# Altium project SDP_2.PrjPcb
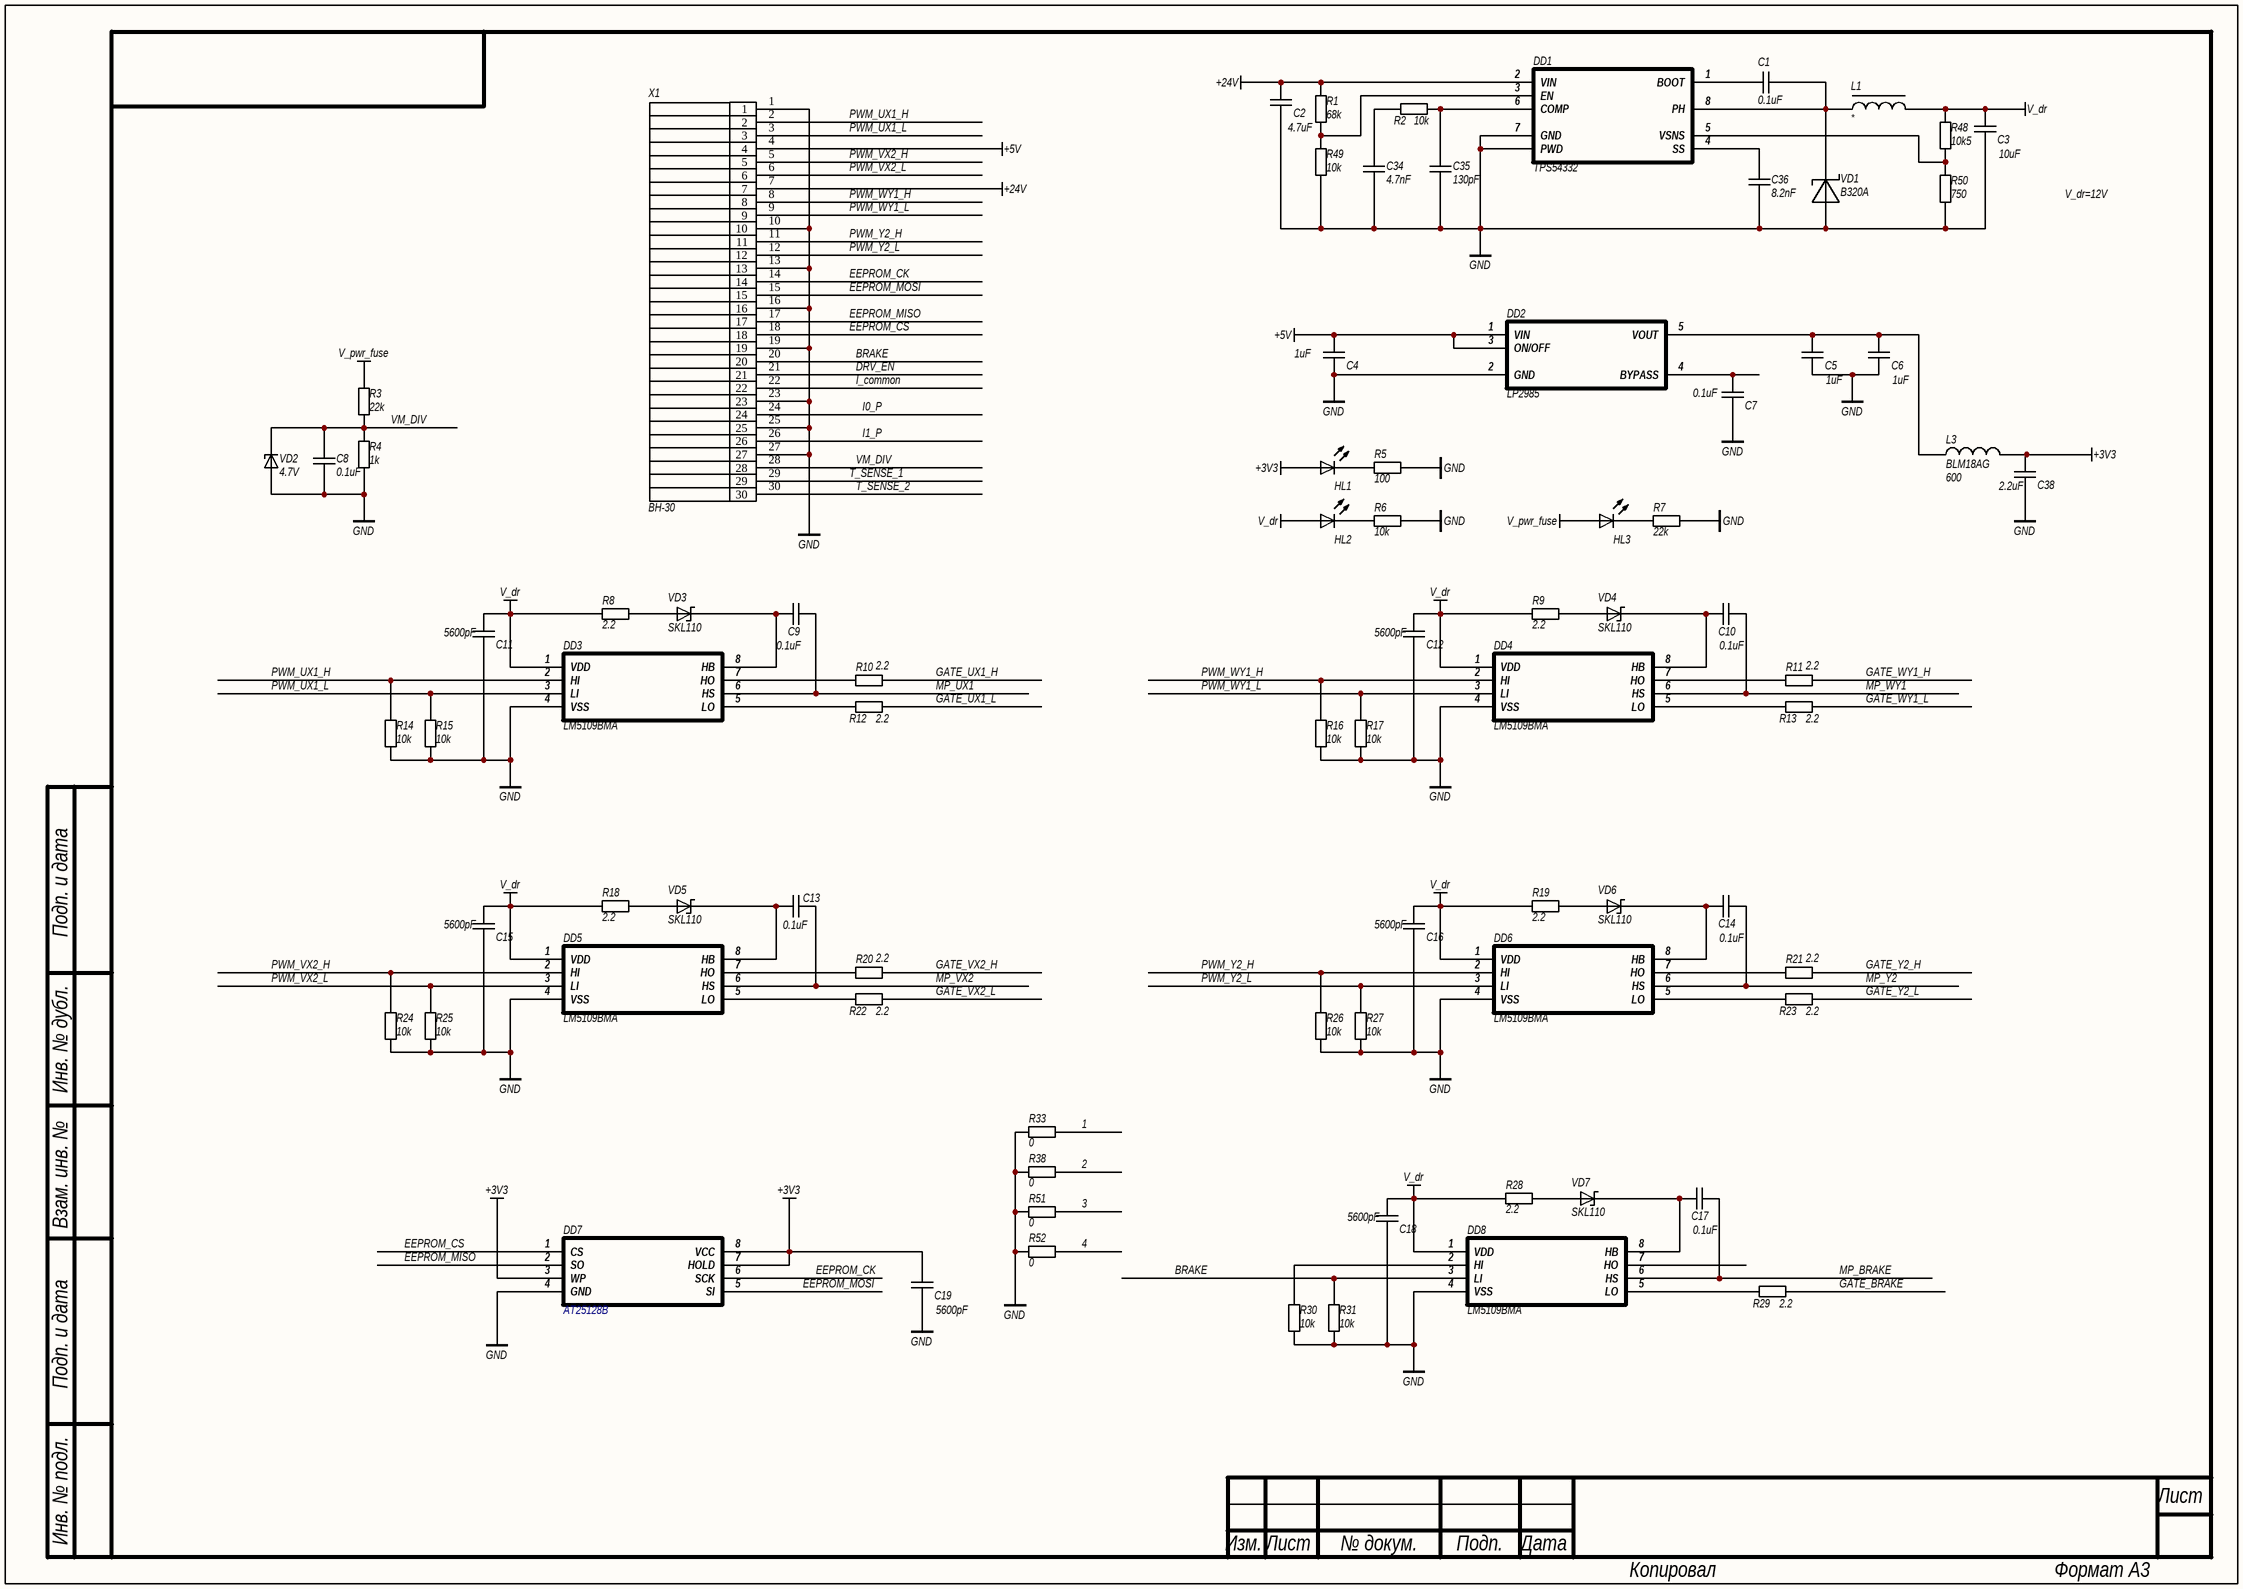
[diagram p0: SDP_1.SchDoc]
2 sheets, 144 parts. Net scope: global (net labels, ports and power ports of the same name join across sheets).
Board file: SDP.PcbDoc
Sheets:
  SDP_1.SchDoc
  SDP_2.SchDoc

## Sheet SDP_1.SchDoc
size 420 x 297 mm; PageSetup: Record=PageOptions|CenterHorizontal=False|CenterVertical=False|PrintScale=0.95|XCorrection=0.00|YCorrection=0.00|PrintKind=1|BorderSize=5000000|LeftOffset=0|BottomOffset=0|Orientation=1|PaperLength=1000|PaperWidth=1000|Scale=100|PaperSource=15|PrintQuality=600|MediaType=1|DitherType=10|PaperKind=A4|PrintScaleMode=1

### Parts
C1  value 0.1uF  [C0603]  (hidden comment: CAP)
C2  value 4.7uF  [C1210]  (hidden comment: CAP)
C3  value 10uF  [C1210]  (hidden comment: CAP)
C4  value 1uF  [C0603]  (hidden comment: CAP)
C5  value 1uF  [C0603]  (hidden comment: CAP)
C6  value 1uF  [C0603]  (hidden comment: CAP)
C7  value 0.1uF  [C0603]  (hidden comment: CAP)
C8  value 0.1uF  [C0603]  (hidden comment: CAP)
C9  value 0.1uF  [C0603]  (hidden comment: CAP)
C10  value 0.1uF  [C0603]  (hidden comment: CAP)
C11  value 5600pF  [C0603]  (hidden comment: CAP)
C12  value 5600pF  [C0603]  (hidden comment: CAP)
C13  value 0.1uF  [C0603]  (hidden comment: CAP)
C14  value 0.1uF  [C0603]  (hidden comment: CAP)
C15  value 5600pF  [C0603]  (hidden comment: CAP)
C16  value 5600pF  [C0603]  (hidden comment: CAP)
C17  value 0.1uF  [C0603]  (hidden comment: CAP)
C18  value 5600pF  [C0603]  (hidden comment: CAP)
C19  value 5600pF  [C0603]  (hidden comment: CAP)
C34  value 4.7nF  [C0603]  (hidden comment: CAP)
C35  value 130pF  [C0603]  (hidden comment: CAP)
C36  value 8.2nF  [C0603]  (hidden comment: CAP)
C38  value 2.2uF  [C0603]  (hidden comment: CAP)
DD1  TPS54332  [DDA]
DD2  LP2985  [SOT23-5]
DD3  LM5109BMA  [SO8_L]
DD4  LM5109BMA  [SO8_L]
DD5  LM5109BMA  [SO8_L]
DD6  LM5109BMA  [SO8_L]
DD7  AT25128B  [SO8_L]
DD8  LM5109BMA  [SO8_L]
HL1  LED0603  [LED0603]  (value not drawn)
HL2  LED0603  [LED0603]  (value not drawn)
HL3  LED0603  [LED0603]  (value not drawn)
L1  XAL5050  [XAL5050]  (value not drawn)
L3  BLM18AG  value 600  [R0603]
R1  value 68k  [R0603]  (hidden comment: RES)
R2  value 10k  [R0603]  (hidden comment: RES)
R3  value 22k  [R0603]  (hidden comment: RES)
R4  value 1k  [R0603]  (hidden comment: RES)
R5  value 100  [R0603]  (hidden comment: RES)
R6  value 10k  [R0603]  (hidden comment: RES)
R7  value 22k  [R0603]  (hidden comment: RES)
R8  value 2.2  [R0603]  (hidden comment: RES)
R9  value 2.2  [R0603]  (hidden comment: RES)
R10  value 2.2  [R0603]  (hidden comment: RES)
R11  value 2.2  [R0603]  (hidden comment: RES)
R12  value 2.2  [R0603]  (hidden comment: RES)
R13  value 2.2  [R0603]  (hidden comment: RES)
R14  value 10k  [R0603]  (hidden comment: RES)
R15  value 10k  [R0603]  (hidden comment: RES)
R16  value 10k  [R0603]  (hidden comment: RES)
R17  value 10k  [R0603]  (hidden comment: RES)
R18  value 2.2  [R0603]  (hidden comment: RES)
R19  value 2.2  [R0603]  (hidden comment: RES)
R20  value 2.2  [R0603]  (hidden comment: RES)
R21  value 2.2  [R0603]  (hidden comment: RES)
R22  value 2.2  [R0603]  (hidden comment: RES)
R23  value 2.2  [R0603]  (hidden comment: RES)
R24  value 10k  [R0603]  (hidden comment: RES)
R25  value 10k  [R0603]  (hidden comment: RES)
R26  value 10k  [R0603]  (hidden comment: RES)
R27  value 10k  [R0603]  (hidden comment: RES)
R28  value 2.2  [R0603]  (hidden comment: RES)
R29  value 2.2  [R0603]  (hidden comment: RES)
R30  value 10k  [R0603]  (hidden comment: RES)
R31  value 10k  [R0603]  (hidden comment: RES)
R33  value 0  [R0603]  (hidden comment: RES)
R38  value 0  [R0603]  (hidden comment: RES)
R48  value 10k5  [R0603]  (hidden comment: RES)
R49  value 10k  [R0603]  (hidden comment: RES)
R50  value 750  [R0603]  (hidden comment: RES)
R51  value 0  [R0603]  (hidden comment: RES)
R52  value 0  [R0603]  (hidden comment: RES)
VD1  B320A  [SMA-DO214]
VD2  Voltage: 4.7V  [SOD323]  (hidden comment: BZX384)
VD3  SKL110  [SOD-123]
VD4  SKL110  [SOD-123]
VD5  SKL110  [SOD-123]
VD6  SKL110  [SOD-123]
VD7  SKL110  [SOD-123]
X1  BH-30  [IDC-30(BH-30)]

### Nets
+3V3: C19.2 C38.2 DD7.3(WP) DD7.7(HOLD) DD7.8(VCC) HL1.1(A) L3.2
+5V: C4.2 DD2.1(VIN) DD2.3(ON/OFF) X1.4
+24V: C2.2 DD1.2(VIN) R1.2 X1.7
GND: C2.1 C3.1 C4.1 C5.1 C6.1 C7.1 C8.1 C11.1 C12.1 C15.1 C16.1 C18.1 C19.1 C34.1 C35.1 C36.1 C38.1 DD1.7(GND) DD1.9(PWD) DD2.2(GND) DD3.4(VSS) DD4.4(VSS) DD5.4(VSS) DD6.4(VSS) DD7.4(GND) DD8.4(VSS) R4.1 R5.1 R6.1 R7.1 R14.1 R15.1 R16.1 R17.1 R24.1 R25.1 R26.1 R27.1 R30.1 R31.1 R33.2 R38.2 R49.1 R50.1 R51.2 R52.2 VD1.1(A) VD2.1(A) X1.1 X1.10 X1.13 X1.16 X1.19 X1.23 X1.25 X1.27
V_dr: C3.2 C11.2 C12.2 C15.2 C16.2 C18.2 DD3.1(VDD) DD4.1(VDD) DD5.1(VDD) DD6.1(VDD) DD8.1(VDD) HL2.1(A) L1.2 R8.1 R9.1 R18.1 R19.1 R28.1 R48.2
V_pwr_fuse: HL3.1(A) R3.2  [project net BR_RES_1]
1: R33.1
2: R38.1
3: R51.1
4: R52.1
BRAKE: DD8.3(LI) R31.2 X1.20
DRV_EN: X1.21
EEPROM_CK: DD7.6(SCK) X1.14
EEPROM_CS: DD7.1(CS) X1.18
EEPROM_MISO: DD7.2(SO) X1.17
EEPROM_MOSI: DD7.5(SI) X1.15
GATE_BRAKE: R29.2
GATE_UX1_H: R10.2
GATE_UX1_L: R12.2
GATE_VX2_H: R20.2
GATE_VX2_L: R22.2
GATE_WY1_H: R11.2
GATE_WY1_L: R13.2
GATE_Y2_H: R21.2
GATE_Y2_L: R23.2
I0_P: X1.24
I1_P: X1.26
I_common: X1.22
MP_BRAKE: C17.2 DD8.6(HS)
MP_UX1: C9.2 DD3.6(HS)
MP_VX2: C13.2 DD5.6(HS)
MP_WY1: C10.2 DD4.6(HS)
MP_Y2: C14.2 DD6.6(HS)
PWM_UX1_H: DD3.2(HI) R14.2 X1.2
PWM_UX1_L: DD3.3(LI) R15.2 X1.3
PWM_VX2_H: DD5.2(HI) R24.2 X1.5
PWM_VX2_L: DD5.3(LI) R25.2 X1.6
PWM_WY1_H: DD4.2(HI) R16.2 X1.8
PWM_WY1_L: DD4.3(LI) R17.2 X1.9
PWM_Y2_H: DD6.2(HI) R26.2 X1.11
PWM_Y2_L: DD6.3(LI) R27.2 X1.12
T_SENSE_1: X1.29
T_SENSE_2: X1.30
VM_DIV: C8.2 R3.1 R4.2 VD2.2(K) X1.28
NetC1_1: C1.1 DD1.8(PH) L1.1 VD1.2(K)
NetC1_2: C1.2 DD1.1(BOOT)
NetC5_2: C5.2 C6.2 DD2.5(VOUT) L3.1
NetC7_2: C7.2 DD2.4(BYPASS)
NetC9_1: C9.1 DD3.8(HB) VD3.2(K)
NetC10_1: C10.1 DD4.8(HB) VD4.2(K)
NetC13_1: C13.1 DD5.8(HB) VD5.2(K)
NetC14_1: C14.1 DD6.8(HB) VD6.2(K)
NetC17_1: C17.1 DD8.8(HB) VD7.2(K)
NetC34_2: C34.2 R2.2
NetC35_2: C35.2 DD1.6(COMP) R2.1
NetC36_2: C36.2 DD1.4(SS)
NetDD1_3: DD1.3(EN) R1.1 R49.2
NetDD1_5: DD1.5(VSNS) R48.1 R50.2
NetDD3_5: DD3.5(LO) R12.1
NetDD3_7: DD3.7(HO) R10.1
NetDD4_5: DD4.5(LO) R13.1
NetDD4_7: DD4.7(HO) R11.1
NetDD5_5: DD5.5(LO) R22.1
NetDD5_7: DD5.7(HO) R20.1
NetDD6_5: DD6.5(LO) R23.1
NetDD6_7: DD6.7(HO) R21.1
NetDD8_2: DD8.2(HI) R30.2
NetDD8_5: DD8.5(LO) R29.1
NetHL1_2: HL1.2(K) R5.2
NetHL2_2: HL2.2(K) R6.2
NetHL3_2: HL3.2(K) R7.2
NetR8_2: R8.2 VD3.1(A)
NetR9_2: R9.2 VD4.1(A)
NetR18_2: R18.2 VD5.1(A)
NetR19_2: R19.2 VD6.1(A)
NetR28_2: R28.2 VD7.1(A)

Not connected (* = marked no-connect by the designer): DD8 7(HO)

### Notes on the sheet
- V_dr=12V
- Подп. и дата
- Инв. № дубл.
- Взам. инв. №
- Инв. № подл.
- Лист
- Изм.
- № докум.
- Подп.
- Дата
- Копировал
- Формат А3

### Library data of the parts
C1 C2 C4-C19 C34-C36 = CAP: SMD Capacitor; Manufacturer: Murata; Material: X7R; Tolerance: 10%; Voltage: 50V; Type: Ceramic Capacitor
C3 = CAP: SMD Capacitor; Manufacturer: Murata; Material: X7R; Tolerance: 10%; Voltage: 25V; Type: Ceramic Capacitor
C38 = CAP: SMD Capacitor; Manufacturer: Murata; Material: X7R; Tolerance: 10%; Voltage: 10V; Type: Ceramic Capacitor
DD2 = LP2985-33DBV: Regulator
DD3-DD6 DD8 = LM5109BMA: Gate driver
DD7 = AT25128B-SSHL: EEPROM
L1 = XAL5050: chip inductor; value: *
R1-R31 R33 R38 R48-R52 = RES: SMD Resistor; Name: Chip SMD Resistor; Power: 0.062 Wt; Tolerance: 5%; Temperature Range: -55…155°C
VD1 = B320A: Shottky diode
VD3-VD7 = SKL110: Shottky rectifier
X1 = IDC15x2_GOST

## Sheet SDP_2.SchDoc
size 420 x 297 mm; PageSetup: Record=PageOptions|CenterHorizontal=False|CenterVertical=False|PrintScale=0.95|XCorrection=0.00|YCorrection=0.00|PrintKind=1|BorderSize=5000000|LeftOffset=0|BottomOffset=0|Orientation=1|PaperLength=1000|PaperWidth=1000|Scale=100|PaperSource=15|PrintQuality=600|MediaType=1|DitherType=10|PaperKind=A4|PrintScaleMode=1
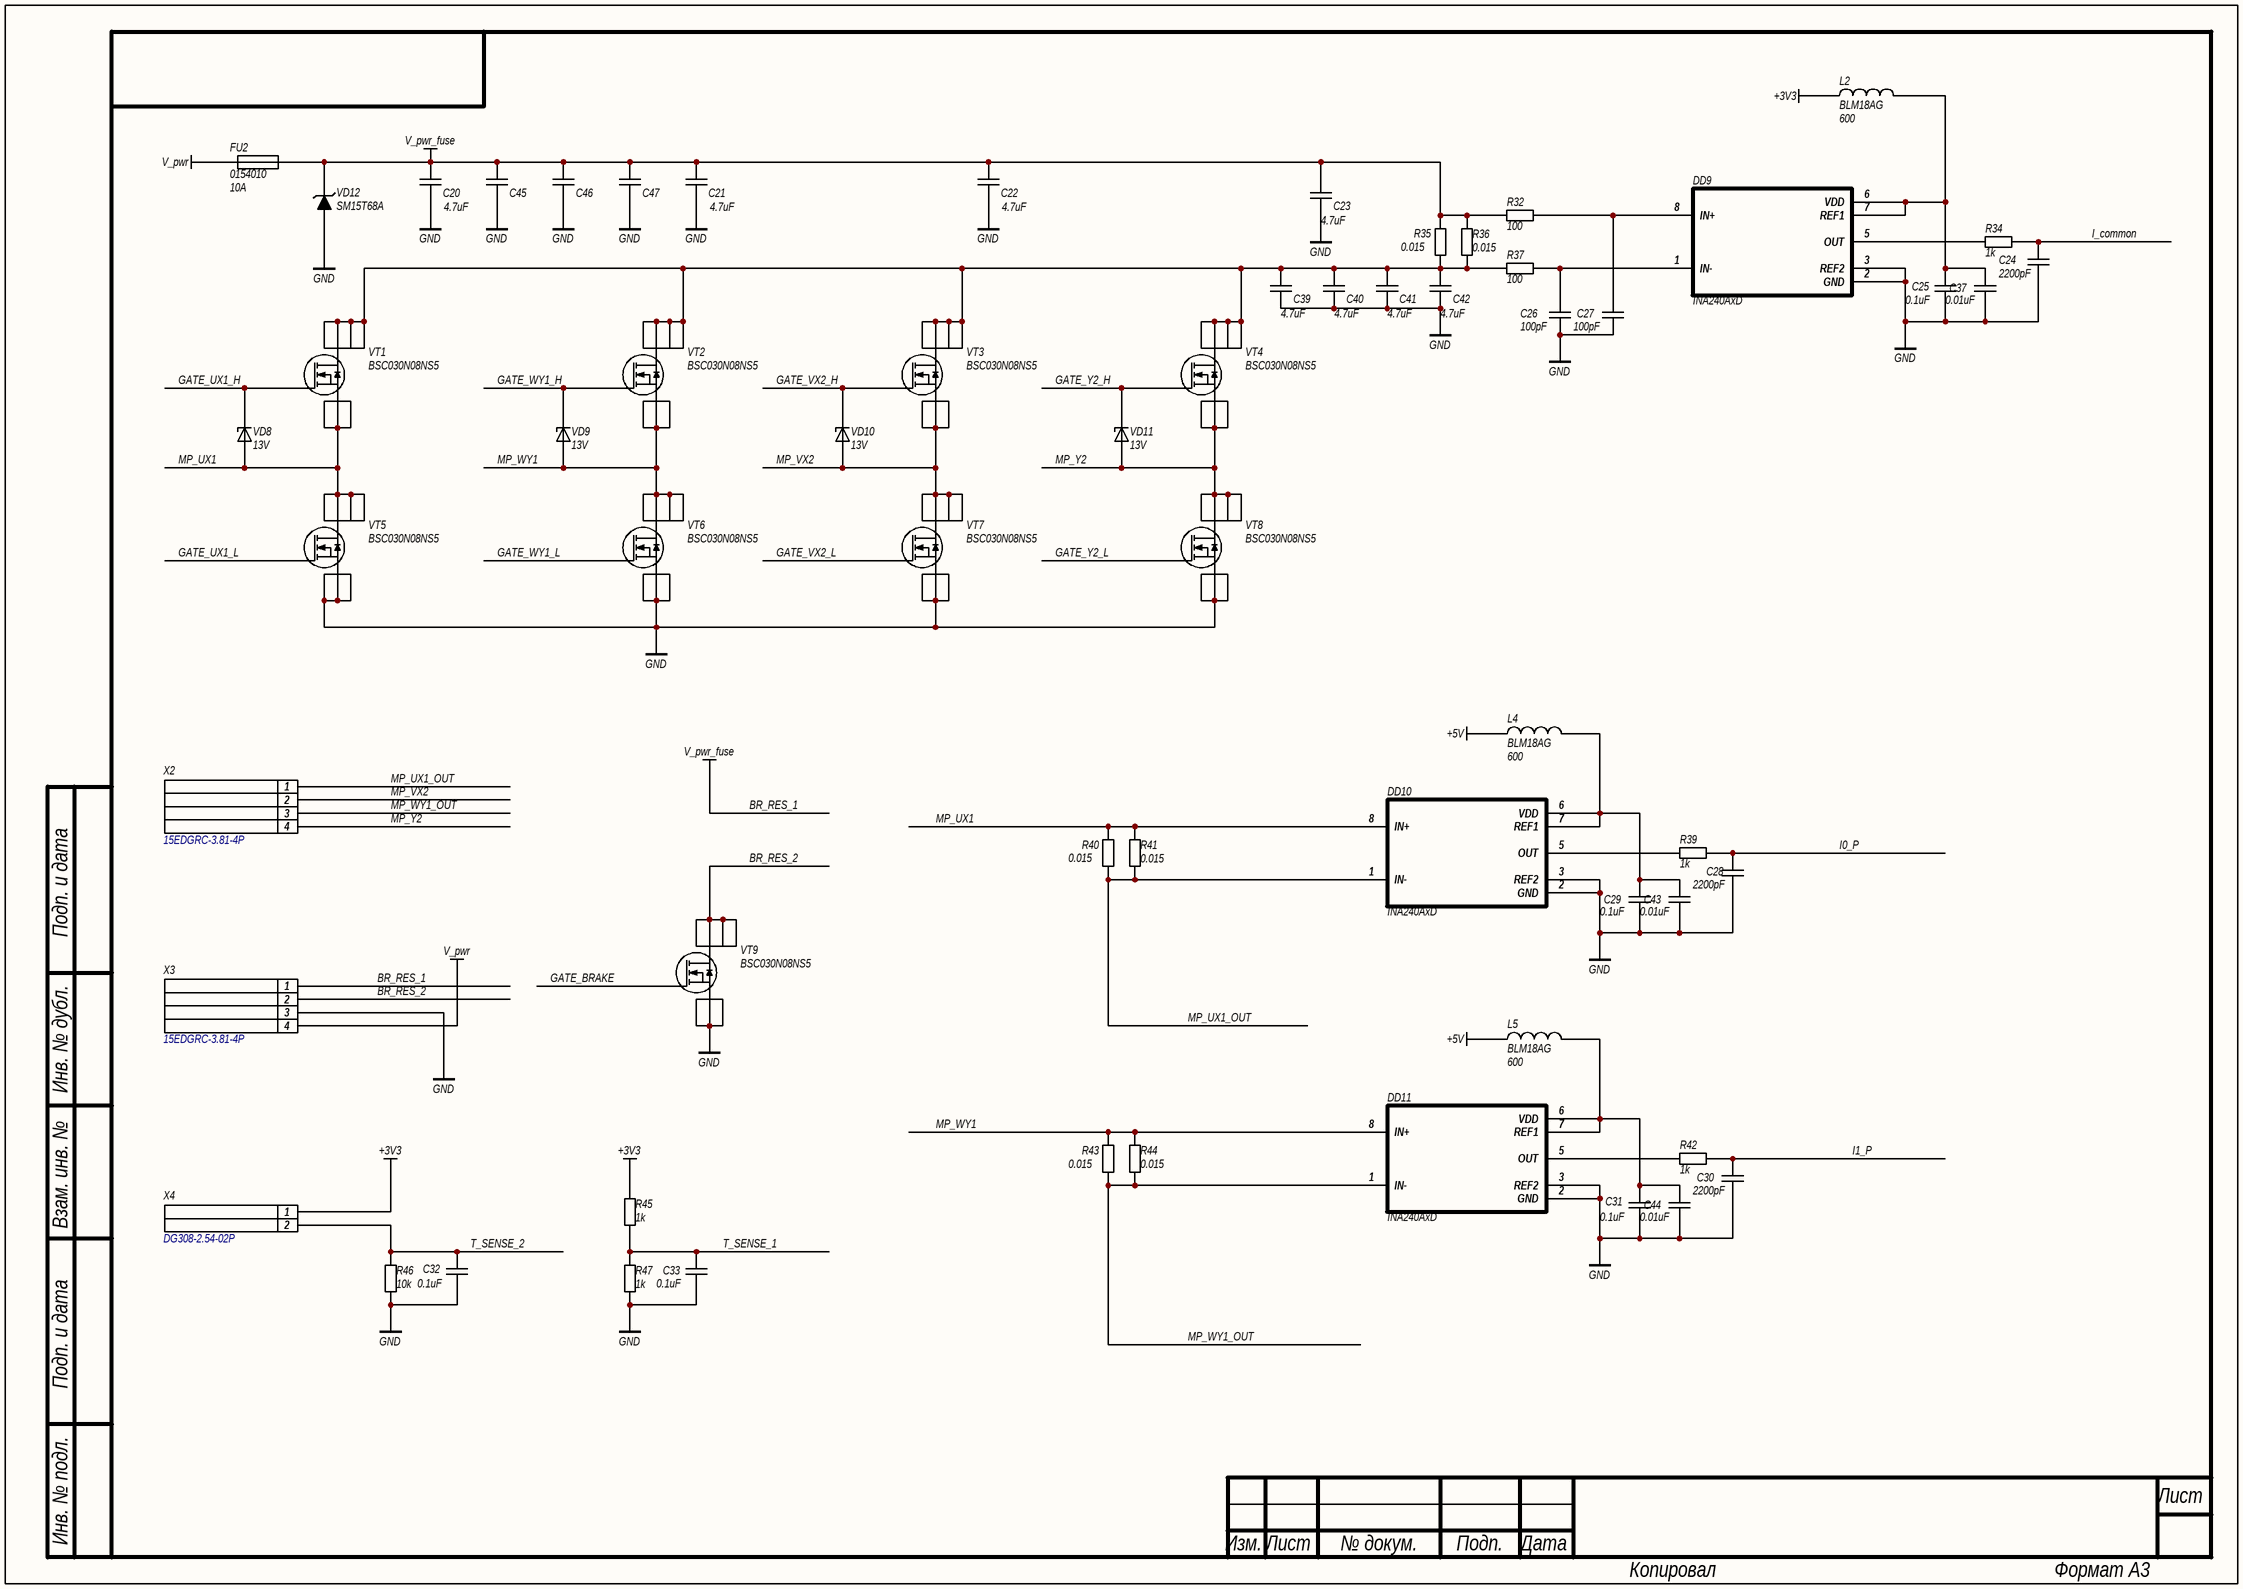
[diagram p1: SDP_2.SchDoc]

### Parts
C20  value 4.7uF  [C1210]  (hidden comment: CAP)
C21  value 4.7uF  [C1210]  (hidden comment: CAP)
C22  value 4.7uF  [C1210]  (hidden comment: CAP)
C23  value 4.7uF  [C1210]  (hidden comment: CAP)
C24  value 2200pF  [C0603]  (hidden comment: CAP)
C25  value 0.1uF  [C0603]  (hidden comment: CAP)
C26  value 100pF  [C0603]  (hidden comment: CAP)
C27  value 100pF  [C0603]  (hidden comment: CAP)
C28  value 2200pF  [C0603]  (hidden comment: CAP)
C29  value 0.1uF  [C0603]  (hidden comment: CAP)
C30  value 2200pF  [C0603]  (hidden comment: CAP)
C31  value 0.1uF  [C0603]  (hidden comment: CAP)
C32  value 0.1uF  [C0603]  (hidden comment: CAP)
C33  value 0.1uF  [C0603]  (hidden comment: CAP)
C37  value 0.01uF  [C0603]  (hidden comment: CAP)
C39  value 4.7uF  [C1210]  (hidden comment: CAP)
C40  value 4.7uF  [C1210]  (hidden comment: CAP)
C41  value 4.7uF  [C1210]  (hidden comment: CAP)
C42  value 4.7uF  [C1210]  (hidden comment: CAP)
C43  value 0.01uF  [C0603]  (hidden comment: CAP)
C44  value 0.01uF  [C0603]  (hidden comment: CAP)
C45  CAP  [C2220]  (value not drawn)
C46  CAP  [C2220]  (value not drawn)
C47  CAP  [C2220]  (value not drawn)
DD9  INA240AxD  [SO8_L]
DD10  INA240AxD  [SO8_L]
DD11  INA240AxD  [SO8_L]
FU2  0154010  current: 10A  [omni_block_154]
L2  BLM18AG  value 600  [R0603]
L4  BLM18AG  value 600  [R0603]
L5  BLM18AG  value 600  [R0603]
R32  value 100  [R0603]  (hidden comment: RES)
R34  value 1k  [R0603]  (hidden comment: RES)
R35  value 0.015  [R2512]  (hidden comment: 2512)
R36  value 0.015  [R2512]  (hidden comment: 2512)
R37  value 100  [R0603]  (hidden comment: RES)
R39  value 1k  [R0603]  (hidden comment: RES)
R40  value 0.015  [R2512]  (hidden comment: 2512)
R41  value 0.015  [R2512]  (hidden comment: 2512)
R42  value 1k  [R0603]  (hidden comment: RES)
R43  value 0.015  [R2512]  (hidden comment: 2512)
R44  value 0.015  [R2512]  (hidden comment: 2512)
R45  value 1k  [R0603]  (hidden comment: RES)
R46  value 10k  [R0603]  (hidden comment: RES)
R47  value 1k  [R0603]  (hidden comment: RES)
VD8  Voltage: 13V  [SOD323]  (hidden comment: BZX384)
VD9  Voltage: 13V  [SOD323]  (hidden comment: BZX384)
VD10  Voltage: 13V  [SOD323]  (hidden comment: BZX384)
VD11  Voltage: 13V  [SOD323]  (hidden comment: BZX384)
VD12  SM15T68A  [SMC-DO214]
VT1  BSC030N08NS5  [TDSON-8]
VT2  BSC030N08NS5  [TDSON-8]
VT3  BSC030N08NS5  [TDSON-8]
VT4  BSC030N08NS5  [TDSON-8]
VT5  BSC030N08NS5  [TDSON-8]
VT6  BSC030N08NS5  [TDSON-8]
VT7  BSC030N08NS5  [TDSON-8]
VT8  BSC030N08NS5  [TDSON-8]
VT9  BSC030N08NS5  [TDSON-8]
X2  15EDGRC-3.81-4P  [15EDGRC]
X3  15EDGRC-3.81-4P  [15EDGRC]
X4  DG308-2.54-02P  [DG308-2.54-2]

### Nets
+3V3: L2.1 R45.2 X4.1
+5V: L4.1 L5.1
BR_RES_1: C20.2 C21.2 C22.2 C23.2 C45.2 C46.2 C47.2 FU2.2 R32.1 R35.2 R36.2 VD12.2(B) X3.1  [also labelled V_pwr_fuse]
GND: C20.1 C21.1 C22.1 C23.1 C24.1 C25.1 C26.1 C27.1 C28.1 C29.1 C30.1 C31.1 C32.1 C33.1 C37.1 C39.1 C40.1 C41.1 C42.1 C43.1 C44.1 C45.1 C46.1 C47.1 DD9.2(GND) DD9.3(REF2) DD10.2(GND) DD10.3(REF2) DD11.2(GND) DD11.3(REF2) R46.1 R47.1 VD12.1(A) VT5.1(S) VT5.2(S) VT5.3(S) VT6.1(S) VT6.2(S) VT6.3(S) VT7.1(S) VT7.2(S) VT7.3(S) VT8.1(S) VT8.2(S) VT8.3(S) VT9.1(S) VT9.2(S) VT9.3(S) X3.3
V_pwr: FU2.1 X3.4
BR_RES_2: VT9.5(D) VT9.6(D) VT9.7(D) VT9.8(D) X3.2
GATE_BRAKE: VT9.4(G)
GATE_UX1_H: VD8.2(K) VT1.4(G)
GATE_UX1_L: VT5.4(G)
GATE_VX2_H: VD10.2(K) VT3.4(G)
GATE_VX2_L: VT7.4(G)
GATE_WY1_H: VD9.2(K) VT2.4(G)
GATE_WY1_L: VT6.4(G)
GATE_Y2_H: VD11.2(K) VT4.4(G)
GATE_Y2_L: VT8.4(G)
I0_P: C28.2 R39.2
I1_P: C30.2 R42.2
I_common: C24.2 R34.2
MP_UX1: DD10.8(IN+) R40.2 R41.2 VD8.1(A) VT1.1(S) VT1.2(S) VT1.3(S) VT5.5(D) VT5.6(D) VT5.7(D) VT5.8(D)
MP_UX1_OUT: DD10.1(IN-) R40.1 R41.1 X2.1
MP_VX2: VD10.1(A) VT3.1(S) VT3.2(S) VT3.3(S) VT7.5(D) VT7.6(D) VT7.7(D) VT7.8(D) X2.2
MP_WY1: DD11.8(IN+) R43.2 R44.2 VD9.1(A) VT2.1(S) VT2.2(S) VT2.3(S) VT6.5(D) VT6.6(D) VT6.7(D) VT6.8(D)
MP_WY1_OUT: DD11.1(IN-) R43.1 R44.1 X2.3
MP_Y2: VD11.1(A) VT4.1(S) VT4.2(S) VT4.3(S) VT8.5(D) VT8.6(D) VT8.7(D) VT8.8(D) X2.4
T_SENSE_1: C33.2 R45.1 R47.2
T_SENSE_2: C32.2 R46.2 X4.2
NetC25_2: C25.2 C37.2 DD9.6(VDD) DD9.7(REF1) L2.2
NetC26_2: C26.2 DD9.1(IN-) R37.2
NetC27_2: C27.2 DD9.8(IN+) R32.2
NetC29_2: C29.2 C43.2 DD10.6(VDD) DD10.7(REF1) L4.2
NetC31_2: C31.2 C44.2 DD11.6(VDD) DD11.7(REF1) L5.2
NetC39_2: C39.2 C40.2 C41.2 C42.2 R35.1 R36.1 R37.1 VT1.5(D) VT1.6(D) VT1.7(D) VT1.8(D) VT2.5(D) VT2.6(D) VT2.7(D) VT2.8(D) VT3.5(D) VT3.6(D) VT3.7(D) VT3.8(D) VT4.5(D) VT4.6(D) VT4.7(D) VT4.8(D)
NetDD9_5: DD9.5(OUT) R34.1
NetDD10_5: DD10.5(OUT) R39.1
NetDD11_5: DD11.5(OUT) R42.1

### Notes on the sheet
- Подп. и дата
- Инв. № дубл.
- Взам. инв. №
- Инв. № подл.
- Лист
- Изм.
- № докум.
- Подп.
- Дата
- Копировал
- Формат А3

### Library data of the parts
C20-C23 C39-C42 = CAP: SMD Capacitor; Manufacturer: Murata; Material: X7R; Tolerance: 10%; Voltage: 100V; Type: Ceramic Capacitor
C24-C33 C37 C43 C44 = CAP: as C1 on sheet SDP_1
C45-C47 = CAP: SMD Capacitor; Manufacturer: Murata; Material: X7R; Tolerance: 10%; Voltage: 100V; Type: Ceramic Capacitor; Value: 10uF
DD9-DD11 = INA240AxD: Current_sesnse_amplifier
FU2 = 0154010: omni fuse block
R32 R34 R37 R39 R42 R45-R47 = RES: as R1 on sheet SDP_1; Temperature Range: -55…155°C
R35 R36 R40 R41 R43 R44 = RES2512: SMD Resistor; Name: Chip SMD Resistor; Power: 1 W; Tolerance: 5%; Temperature Range: -55…155°C
VD12 = SM15T68A: TVSdiode
VT1-VT9 = BSC030N08NS5: MOSFET-N

## Nets that join several sheets
+3V3: SDP_1 (7 pins), SDP_2 (L2.1 R45.2 X4.1)
+5V: SDP_1 (C4.2 DD2.1 DD2.3 X1.4), SDP_2 (L4.1 L5.1)
BR_RES_1: SDP_1 (HL3.1 R3.2), SDP_2 (13 pins)
GND: SDP_1 (56 pins), SDP_2 (49 pins)
GATE_BRAKE: SDP_1 (R29.2), SDP_2 (VT9.4)
GATE_UX1_H: SDP_1 (R10.2), SDP_2 (VD8.2 VT1.4)
GATE_UX1_L: SDP_1 (R12.2), SDP_2 (VT5.4)
GATE_VX2_H: SDP_1 (R20.2), SDP_2 (VD10.2 VT3.4)
GATE_VX2_L: SDP_1 (R22.2), SDP_2 (VT7.4)
GATE_WY1_H: SDP_1 (R11.2), SDP_2 (VD9.2 VT2.4)
GATE_WY1_L: SDP_1 (R13.2), SDP_2 (VT6.4)
GATE_Y2_H: SDP_1 (R21.2), SDP_2 (VD11.2 VT4.4)
GATE_Y2_L: SDP_1 (R23.2), SDP_2 (VT8.4)
I0_P: SDP_1 (X1.24), SDP_2 (C28.2 R39.2)
I1_P: SDP_1 (X1.26), SDP_2 (C30.2 R42.2)
I_common: SDP_1 (X1.22), SDP_2 (C24.2 R34.2)
MP_UX1: SDP_1 (C9.2 DD3.6), SDP_2 (11 pins)
MP_VX2: SDP_1 (C13.2 DD5.6), SDP_2 (9 pins)
MP_WY1: SDP_1 (C10.2 DD4.6), SDP_2 (11 pins)
MP_Y2: SDP_1 (C14.2 DD6.6), SDP_2 (9 pins)
T_SENSE_1: SDP_1 (X1.29), SDP_2 (C33.2 R45.1 R47.2)
T_SENSE_2: SDP_1 (X1.30), SDP_2 (C32.2 R46.2 X4.2)